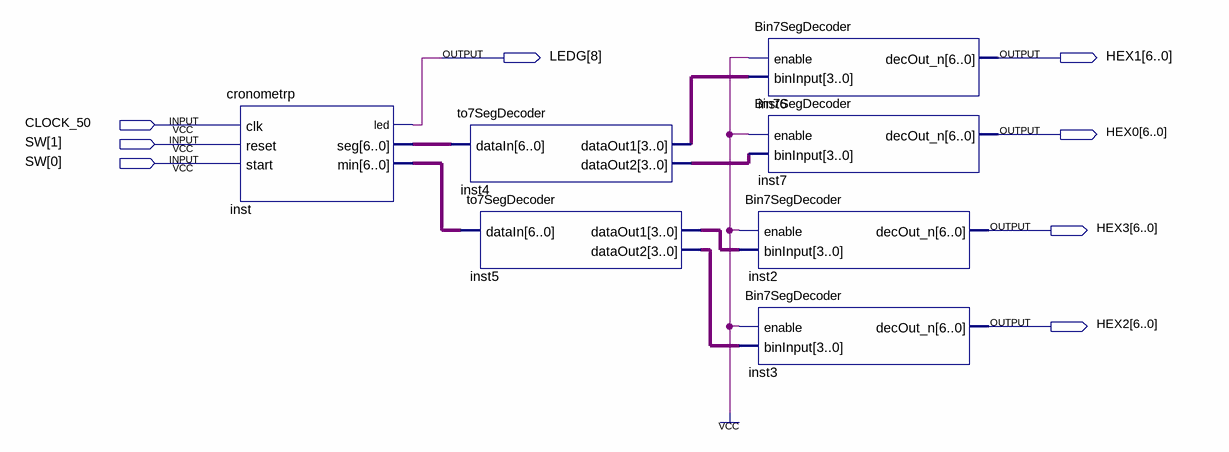
[diagram p0: schematic sheet]
// Quartus schematic Block1.bdf as structural Verilog: 7 symbols, 8 pins
module Block1 (
  input  CLOCK_50,
  input  [1:0] SW,
  output [8:8] LEDG,
  output [6:0] HEX1,
  output [6:0] HEX0,
  output [6:0] HEX3,
  output [6:0] HEX2
);

  wire [3:0] inst4_dataout1, inst4_dataout2, inst5_dataout1, inst5_dataout2;
  wire [6:0] inst_min, inst_seg;

  cronometrp inst (.clk(CLOCK_50), .reset(SW[1]), .start(SW[0]), .led(LEDG[8]), .seg(inst_seg), .min(inst_min));
  to7SegDecoder inst4 (.dataIn(inst_seg), .dataOut1(inst4_dataout1), .dataOut2(inst4_dataout2));
  to7SegDecoder inst5 (.dataIn(inst_min), .dataOut1(inst5_dataout1), .dataOut2(inst5_dataout2));
  Bin7SegDecoder inst6 (.enable(1'b1), .binInput(inst4_dataout1), .decOut_n(HEX1));
  Bin7SegDecoder inst7 (.enable(1'b1), .binInput(inst4_dataout2), .decOut_n(HEX0));
  Bin7SegDecoder inst2 (.enable(1'b1), .binInput(inst5_dataout1), .decOut_n(HEX3));
  Bin7SegDecoder inst3 (.enable(1'b1), .binInput(inst5_dataout2), .decOut_n(HEX2));
endmodule
